# EAGLE schematic greenpak_playground (EAGLE 9.4.2)
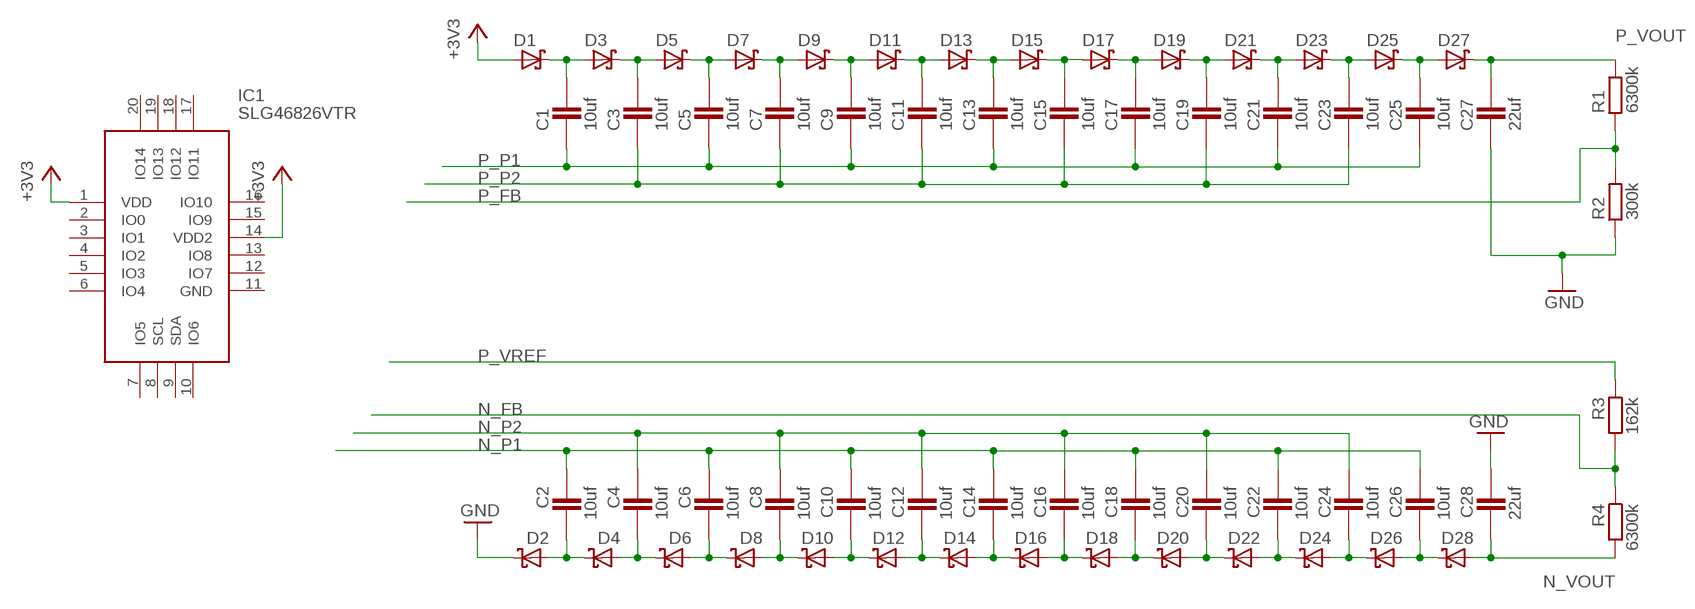
[diagram p0: schematic, sheet 1]

## Parts
C1  10uf  CAPACITOR_1210  [CAPC3225X168N]
C2  10uf  CAPACITOR_1210  [CAPC3225X168N]
C3  10uf  CAPACITOR_1210  [CAPC3225X168N]
C4  10uf  CAPACITOR_1210  [CAPC3225X168N]
C5  10uf  CAPACITOR_1210  [CAPC3225X168N]
C6  10uf  CAPACITOR_1210  [CAPC3225X168N]
C7  10uf  CAPACITOR_1210  [CAPC3225X168N]
C8  10uf  CAPACITOR_1210  [CAPC3225X168N]
C9  10uf  CAPACITOR_1210  [CAPC3225X168N]
C10  10uf  CAPACITOR_1210  [CAPC3225X168N]
C11  10uf  CAPACITOR_1210  [CAPC3225X168N]
C12  10uf  CAPACITOR_1210  [CAPC3225X168N]
C13  10uf  CAPACITOR_1210  [CAPC3225X168N]
C14  10uf  CAPACITOR_1210  [CAPC3225X168N]
C15  10uf  CAPACITOR_1210  [CAPC3225X168N]
C16  10uf  CAPACITOR_1210  [CAPC3225X168N]
C17  10uf  CAPACITOR_1210  [CAPC3225X168N]
C18  10uf  CAPACITOR_1210  [CAPC3225X168N]
C19  10uf  CAPACITOR_1210  [CAPC3225X168N]
C20  10uf  CAPACITOR_1210  [CAPC3225X168N]
C21  10uf  CAPACITOR_1210  [CAPC3225X168N]
C22  10uf  CAPACITOR_1210  [CAPC3225X168N]
C23  10uf  CAPACITOR_1210  [CAPC3225X168N]
C24  10uf  CAPACITOR_1210  [CAPC3225X168N]
C25  10uf  CAPACITOR_1210  [CAPC3225X168N]
C26  10uf  CAPACITOR_1210  [CAPC3225X168N]
C27  22uf  CAPACITOR_1210  [CAPC3225X168N]
C28  22uf  CAPACITOR_1210  [CAPC3225X168N]
D1  SCHOTTKY_SOT-23  [SOT95P280X135-3N]
D2  SCHOTTKY_SOT-23  [SOT95P280X135-3N]
D3  SCHOTTKY_SOT-23  [SOT95P280X135-3N]
D4  SCHOTTKY_SOT-23  [SOT95P280X135-3N]
D5  SCHOTTKY_SOT-23  [SOT95P280X135-3N]
D6  SCHOTTKY_SOT-23  [SOT95P280X135-3N]
D7  SCHOTTKY_SOT-23  [SOT95P280X135-3N]
D8  SCHOTTKY_SOT-23  [SOT95P280X135-3N]
D9  SCHOTTKY_SOT-23  [SOT95P280X135-3N]
D10  SCHOTTKY_SOT-23  [SOT95P280X135-3N]
D11  SCHOTTKY_SOT-23  [SOT95P280X135-3N]
D12  SCHOTTKY_SOT-23  [SOT95P280X135-3N]
D13  SCHOTTKY_SOT-23  [SOT95P280X135-3N]
D14  SCHOTTKY_SOT-23  [SOT95P280X135-3N]
D15  SCHOTTKY_SOT-23  [SOT95P280X135-3N]
D16  SCHOTTKY_SOT-23  [SOT95P280X135-3N]
D17  SCHOTTKY_SOT-23  [SOT95P280X135-3N]
D18  SCHOTTKY_SOT-23  [SOT95P280X135-3N]
D19  SCHOTTKY_SOT-23  [SOT95P280X135-3N]
D20  SCHOTTKY_SOT-23  [SOT95P280X135-3N]
D21  SCHOTTKY_SOT-23  [SOT95P280X135-3N]
D22  SCHOTTKY_SOT-23  [SOT95P280X135-3N]
D23  SCHOTTKY_SOT-23  [SOT95P280X135-3N]
D24  SCHOTTKY_SOT-23  [SOT95P280X135-3N]
D25  SCHOTTKY_SOT-23  [SOT95P280X135-3N]
D26  SCHOTTKY_SOT-23  [SOT95P280X135-3N]
D27  SCHOTTKY_SOT-23  [SOT95P280X135-3N]
D28  SCHOTTKY_SOT-23  [SOT95P280X135-3N]
IC1  SLG46826VTR  [QFN40P200X300X60-20N]
R1  6300k  RESISTOR_0805  [RESC2012X70N]
R2  300k  RESISTOR_0805  [RESC2012X70N]
R3  162k  RESISTOR_0805  [RESC2012X70N]
R4  6300k  RESISTOR_0805  [RESC2012X70N]

## Nets
+3V3: D1.1(A) IC1.1(VDD) IC1.14(VDD2)
GND: C27.1 C28.1 D2.3(C) R2.1
N$1: C1.2 D1.3(C) D3.1(A)
N$2: C3.2 D3.3(C) D5.1(A)
N$3: C5.2 D5.3(C) D7.1(A)
N$4: C7.2 D7.3(C) D9.1(A)
N$5: C9.2 D9.3(C) D11.1(A)
N$6: C11.2 D11.3(C) D13.1(A)
N$7: C13.2 D13.3(C) D15.1(A)
N$8: C15.2 D15.3(C) D17.1(A)
N$9: C2.2 D2.1(A) D4.3(C)
N$10: C4.2 D4.1(A) D6.3(C)
N$12: C6.2 D6.1(A) D8.3(C)
N$13: C8.2 D8.1(A) D10.3(C)
N$14: C10.2 D10.1(A) D12.3(C)
N$15: C12.2 D12.1(A) D14.3(C)
N$16: C14.2 D14.1(A) D16.3(C)
N$17: C16.2 D16.1(A) D18.3(C)
N$18: C18.2 D18.1(A) D20.3(C)
N$19: C26.2 D26.1(A) D28.3(C)
N$22: C17.2 D17.3(C) D19.1(A)
N$30: C19.2 D19.3(C) D21.1(A)
N$31: C21.2 D21.3(C) D23.1(A)
N$32: C23.2 D23.3(C) D25.1(A)
N$33: C25.2 D25.3(C) D27.1(A)
N$34: C24.2 D24.1(A) D26.3(C)
N$35: C22.2 D22.1(A) D24.3(C)
N$36: C20.2 D20.1(A) D22.3(C)
N_FB: R3.2 R4.1
N_P1: C2.1 C6.1 C10.1 C14.1 C18.1 C22.1 C26.1
N_P2: C4.1 C8.1 C12.1 C16.1 C20.1 C24.1
N_VOUT: C28.2 D28.1(A) R4.2
P_FB: R1.1 R2.2
P_P1: C1.1 C5.1 C9.1 C13.1 C17.1 C21.1 C25.1
P_P2: C3.1 C7.1 C11.1 C15.1 C19.1 C23.1
P_VOUT: C27.2 D27.3(C) R1.2
P_VREF: R3.1
Unconnected: IC1.2(IO0) IC1.3(IO1) IC1.4(IO2) IC1.5(IO3) IC1.6(IO4) IC1.7(IO5) IC1.8(SCL) IC1.9(SDA) IC1.10(IO6) IC1.12(IO7) IC1.13(IO8) IC1.15(IO9) IC1.16(IO10) IC1.17(IO11) IC1.18(IO12) IC1.19(IO13) IC1.20(IO14)

## Power pins joined to a net without a drawn wire
GND: IC1.11(GND)

## Library data of the parts
C1-C28 = ipc-7351-capacitor:CAPACITOR_; SPICEPREFIX: C
D1-D28 = ipc-7351-diode:SCHOTTKY_; SPICEMODEL: DMOD; SPICEPREFIX: D
IC1 = SLG46826VTR:SLG46826VTR: DIALOG SEMICONDUCTOR - SLG46826VTR - PROG MIXED SIGNAL MATRIX W/ISP, STQFN-20 Source: Datasheet <https://componentsearchengine.com/Datasheets/2/SLG46826VTR.pdf>; DESCRIPTION: DIALOG SEMICONDUCTOR - SLG46826VTR - PROG MIXED SIGNAL MATRIX W/ISP, STQFN-20; HEIGHT: 0.6mm; MANUFACTURER_NAME: Dialog Semiconductor; MANUFACTURER_PART_NUMBER: SLG46826VTR
R1-R4 = ipc-7351-resistor:RESISTOR_; SPICEPREFIX: R